# EAGLE design VCF-LM324-Stereo+LFO (EAGLE 7.6.0)
Voltage-Controlled Low-Pass Filter with LFO using LM324 Quad-Opamp (Stereo) http://electro-music.com/forum/topic-45231-0.html&postdays=0&postorder=asc&highlight=
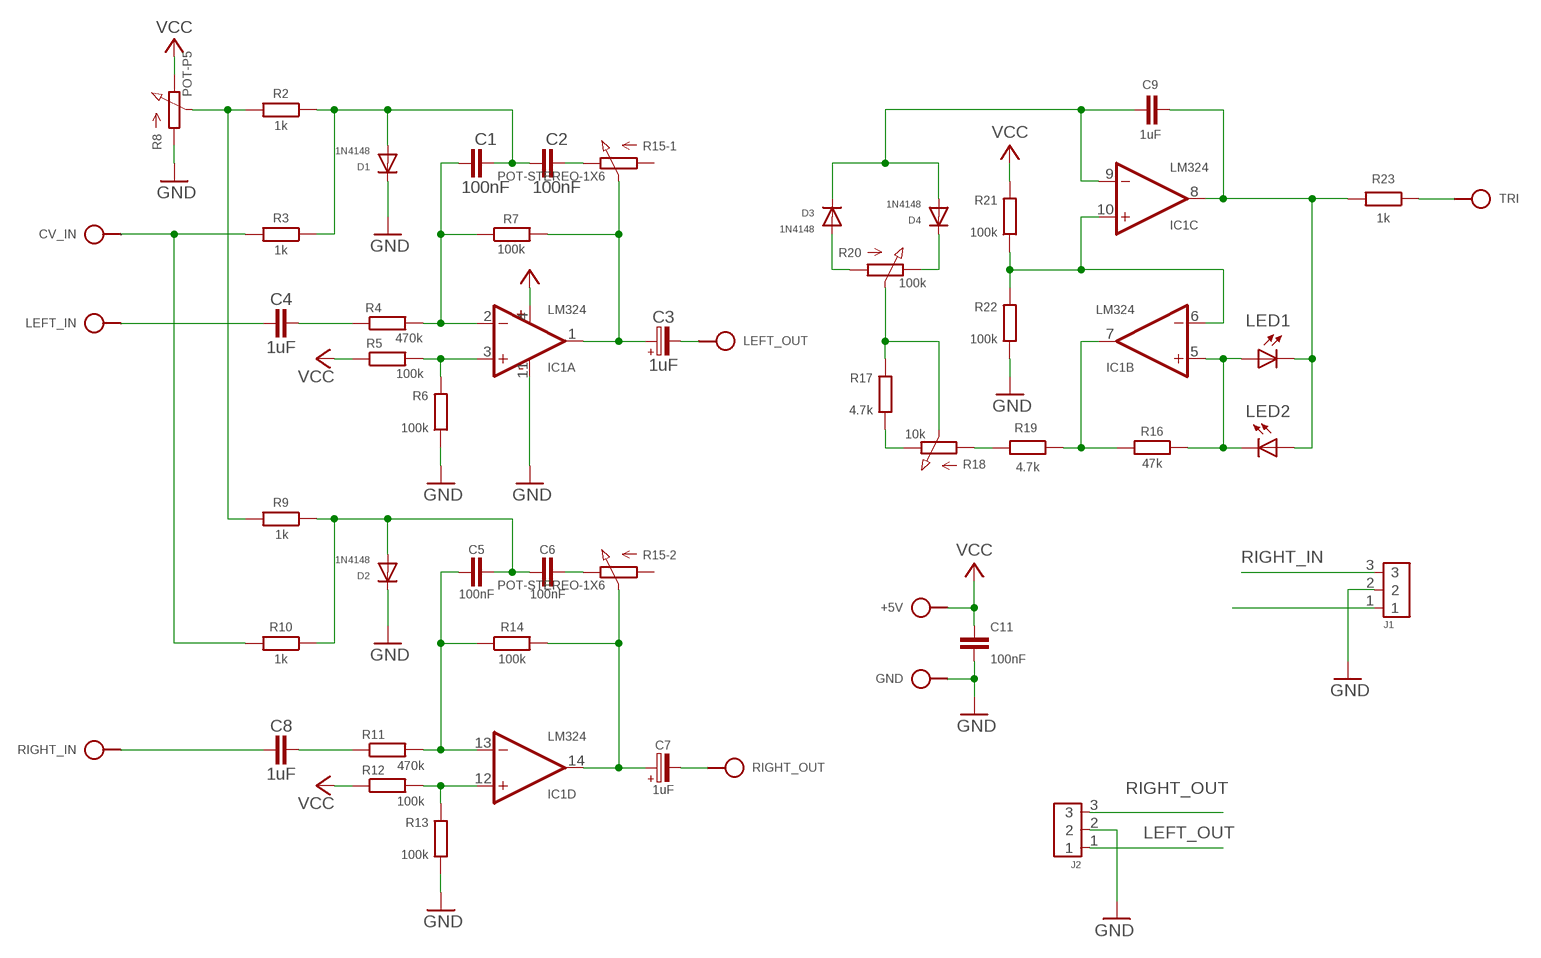
[diagram p0: schematic, sheet 1]

## Parts
+5V  VCC  SPAD  [SPAD]
C1  100nF  C050-024X044  [C050-024X044]
C2  100nF  C050-024X044  [C050-024X044]
C3  1uF  CPOLE2,5-3  [E2,5-3]
C4  1uF  C050-020X044  [C050-020X044]
C5  100nF  C050-024X044  [C050-024X044]
C6  100nF  C050-024X044  [C050-024X044]
C7  1uF  CPOLE2,5-3  [E2,5-3]
C8  1uF  C050-020X044  [C050-020X044]
C9  1uF  C050-024X044/V  [C050-024X044/V]
C11  100nF  C050-020X036  [C050-020X036]
CV_IN  CV_IN  SPAD  [SPAD]
D1  1N4148  1N414834-5  [DO34-5]
D2  1N4148  1N414834-7V  [DO34-7V]
D3  1N4148  1N414834-7V  [DO34-7V]
D4  1N4148  1N414834-7V  [DO34-7V]
GND  GND  SPAD  [SPAD]
IC1  LM324  LM324N  [DIL14]
J1  CONN-3P-3P  [CONN-3P]
J2  CONN-3P-3P  [CONN-3P]
LED1  LED3MM  [LED3MM]
LED2  LED3MM  [LED3MM]
LEFT_IN  AUDIO_IN  SPAD  [SPAD]
LEFT_OUT  AUDIO_OUT  SPAD  [SPAD]
R2  1k  R0204/10-V  [0204/10-V]
R3  1k  R0204/7-V  [0204/7-V]
R4  470k  R0204/10-V  [0204/10-V]
R5  100k  R0204V  [0204V]
R6  100k  R0204/10  [0204/10]
R7  100k  R0204/7-V  [0204/7-V]
R8  POT-P5  [POT-P5]
R9  1k  R0204/7-V  [0204/7-V]
R10  1k  R0202/7-V  [0202/7-V]
R11  470k  R0204/10  [0204/10]
R12  100k  R0204/7-V  [0204/7-V]
R13  100k  R0204V  [0204V]
R14  100k  R0204V  [0204V]
R15  POT-STEREO-1X6  [POT-STEREO-1X6]
R16  47k  R0204/7  [0204/7]
R17  4.7k  R0204/7  [0204/7]
R18  10k  POT  [POT]
R19  4.7k  R0204/7-V  [0204/7-V]
R20  100k  POT  [POT]
R21  100k  R0204/10  [0204/10]
R22  100k  R0202V  [0202V]
R23  1k  R0204/10  [0204/10]
RIGHT_IN  AUDIO_IN  SPAD  [SPAD]
RIGHT_OUT  AUDIO_OUT  SPAD  [SPAD]
TRI  TRIANGLE  SPAD  [SPAD]

## Nets
GND: C11.2 D1.C D2.C GND.1 IC1.11(P:V-) J1.2 J2.2 R6.1 R8.A R13.1 R22.1
LEFT_IN: C4.1 J1.1 LEFT_IN.1
LEFT_OUT: C3.- J2.1 LEFT_OUT.1
N$2: C1.1 IC1.2(A:-IN) R4.2 R7.1
N$3: C2.2 R15.1E(-1:E)
N$4: C3.+ IC1.1(A:OUT) R7.2 R15.1S(-1:S)
N$5: R2.2 R8.S R9.2
N$7: IC1.3(A:+IN) R5.2 R6.2
N$8: CV_IN.1 R3.2 R10.2
N$9: C1.2 C2.1 D1.A R2.1 R3.1
N$10: C4.2 R4.1
N$11: C6.2 R15.2E(-2:E)
N$12: C7.+ IC1.14(D:OUT) R14.2 R15.2S(-2:S)
N$13: IC1.12(D:+IN) R12.2 R13.2
N$14: IC1.7(B:OUT) R16.2 R19.1
N$15: IC1.5(B:+IN) LED1.A LED2.K(C) R16.1
N$16: C5.2 C6.1 D2.A R9.1 R10.1
N$17: C5.1 IC1.13(D:-IN) R11.2 R14.1
N$20: C8.2 R11.1
N$26: C9.1 D3.C D4.A IC1.9(C:-IN)
N$28: C9.2 IC1.8(C:OUT) LED1.K(C) LED2.A R23.2
OA_C_IN+: IC1.6(B:-IN) IC1.10(C:+IN) R21.1 R22.2
RIGHT_IN: C8.1 J1.3 RIGHT_IN.1
RIGHT_OUT: C7.- J2.3 RIGHT_OUT.1
TRI_OUT: R23.1 TRI.1
TRIM_1_A: D3.A R20.1(A)
TRIM_1_B: D4.C R20.3(E)
TRIM_2_A: R17.1 R18.3(E)
TRIM_2_B: R18.1(A) R19.2
TRIM_P: R17.2 R18.2(S) R20.2(S)
VCC: +5V.1 C11.1 IC1.4(P:V+) R5.1 R8.E R12.1 R21.2
Unconnected: R15.1A(-1:A) R15.2A(-2:A)

## Library data of the parts
+5V CV_IN GND LEFT_IN LEFT_OUT RIGHT_IN RIGHT_OUT TRI = pad:SPAD
C1 C2 C4-C6 C8 C9 C11 = c:C: CAPACITOR, European symbol
C3 C7 = c:CPOL: POLARIZED CAPACITOR, European symbol
D1-D4 = d:1N4148
IC1 = ic:LM324: OP AMP
J1 J2 = pinconn:CONN-3P
LED1 LED2 = led:LED: LED OSRAM: - CHIPLED LG R971, LG N971, LY N971, LG Q971, LY Q971, LO R971, LY R971 LH N974, LH R974 LS Q976, LO Q976, LY Q976 LO Q996 - Hyper CHIPLED LW Q18S LB Q993, LB Q99A, LB R99A - SideLED LS A670, LO A670, LY A670, LG A670, LP A670 LB A673, LV A673, LT A673, LW A673 LH A674 LY A675 LS A676, LA A676, LO A676, LY A676, LW A676 LS A679, LY A679, LG A679 - Hyper Micro SIDELED@@ LS Y876, LA Y876, LO Y876, LY Y876 LT Y87S - SmartLED LW L88C, LW L88S LB L89C, LB L89S, LG L890 LS L89K, LO L89K, LY L89K LS L896, LA L896, LO L896, LY L896 - TOPLED LS T670, LO T670, LY T670, LG T670, LP T670 LSG T670, LSP T670, LSY T670, LOP T670, LYG T670 LG T671, LOG T671, LSG T671 LB T673, LV T673, LT T673, LW T673 LH T674 LS T676, LA T676, LO T676, LY T676, LB T676, LH T676, LSB T676, LW T676 LB T67C, LV T67C, LT T67C, LS T67K, LO T67K, LY T67K, LW E67C LS E67B, LA E67B, LO E67B, LY E67B, LB E67C, LV E67C, LT E67C LW T67C LS T679, LY T679, LG T679 LS T770, LO T770, LY T770, LG T770, LP T770 LB T773, LV T773, LT T773, LW T773 LH T774 LS E675, LA E675, LY E675, LS T675 LS T776, LA T776, LO T776, LY T776, LB T776 LHGB T686 LT T68C, LB T68C - Hyper Mini TOPLED@@ LB M676 - Mini TOPLED Santana@@ LG M470 LS M47K, LO M47K, LY M47K Source: http://www.osram.convergy.de LUXEON: - LUMILED@@ LXK2-PW12-R00, LXK2-PW12-S00, LXK2-PW14-U00, LXK2-PW14-V00 LXK2-PM12-R00, LXK2-PM12-S00, LXK2-PM14-U00 LXK2-PE12-Q00, LXK2-PE12-R00, LXK2-PE12-S00, LXK2-PE14-T00, LXK2-PE14-U00 LXK2-PB12-K00, LXK2-PB12-L00, LXK2-PB12-M00, LXK2-PB14-N00, LXK2-PB14-P00, LXK2-PB14-Q00 LXK2-PR12-L00, LXK2-PR12-M00, LXK2-PR14-Q00, LXK2-PR14-R00 LXK2-PD12-Q00, LXK2-PD12-R00, LXK2-PD12-S00 LXK2-PH12-R00, LXK2-PH12-S00 LXK2-PL12-P00, LXK2-PL12-Q00, LXK2-PL12-R00 Source: www.luxeon.com KINGBRIGHT: KA-3528ASYC Source: www.kingbright.com
R2-R7 R9-R14 R16 R17 R19 R21-R23 = r:R: RESISTOR, European symbol
R8 R18 R20 = r:POT
R15 = r:POT-STEREO

## Module LFO
Ports: TRI_OUT(io) GND(io) VCC(io)
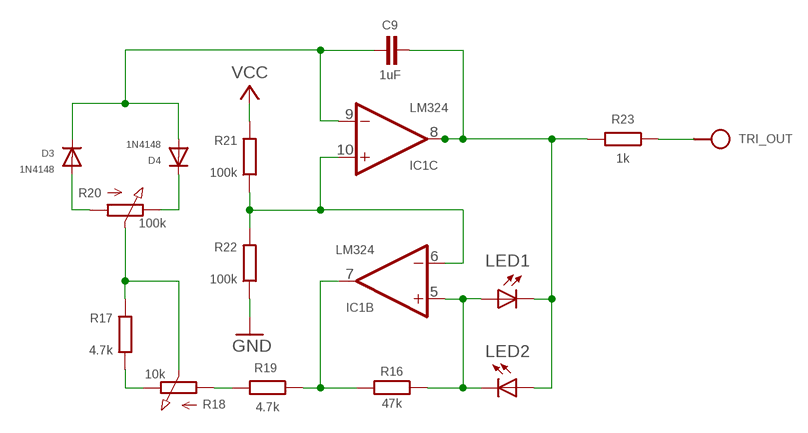
[diagram p1: schematic, module LFO, sheet 1]

### Parts
C9  1uF  C050-024X044/V  [C050-024X044/V]
D3  1N4148  1N414834-7V  [DO34-7V]
D4  1N4148  1N414834-7V  [DO34-7V]
IC1  LM324  LM324N  [DIL14]
LED1  LED3MM  [LED3MM]
LED2  LED3MM  [LED3MM]
R16  47k  R0202/7-V  [0202/7-V]
R17  4.7k  R0202/7  [0202/7]
R18  10k  POT  [POT]
R19  4.7k  R0202/7-V  [0202/7-V]
R20  100k  POT  [POT]
R21  100k  R0202/7-V  [0202/7-V]
R22  100k  R0202/7-V  [0202/7-V]
R23  1k  R0202/7-V  [0202/7-V]
TRI_OUT  TRIANGLE  SPAD  [SPAD]

### Nets
GND: R22.1
N$14: IC1.7(B:OUT) R16.2 R19.1
N$15: IC1.5(B:+IN) LED1.A LED2.K(C) R16.1
N$26: C9.1 D3.C D4.A IC1.9(C:-IN)
N$28: C9.2 IC1.8(C:OUT) LED1.K(C) LED2.A R23.2
OA_C_IN+: IC1.6(B:-IN) IC1.10(C:+IN) R21.1 R22.2
TRI_OUT: R23.1 TRI_OUT.1
TRIM_1_A: D3.A R20.1(A)
TRIM_1_B: D4.C R20.3(E)
TRIM_2_A: R17.1 R18.3(E)
TRIM_2_B: R18.1(A) R19.2
TRIM_P: R17.2 R18.2(S) R20.2(S)
VCC: R21.2
Unconnected: IC1.1(A:OUT) IC1.2(A:-IN) IC1.3(A:+IN) IC1.12(D:+IN) IC1.13(D:-IN) IC1.14(D:OUT)

### Power pins joined to a net without a drawn wire
V+: IC1.4(P:V+)
V-: IC1.11(P:V-)

### Library data of the parts
C9 = c:C: CAPACITOR, European symbol
D3 D4 = d:1N4148
IC1 = ic:LM324: OP AMP
LED1 LED2 = led:LED: LED OSRAM: - CHIPLED LG R971, LG N971, LY N971, LG Q971, LY Q971, LO R971, LY R971 LH N974, LH R974 LS Q976, LO Q976, LY Q976 LO Q996 - Hyper CHIPLED LW Q18S LB Q993, LB Q99A, LB R99A - SideLED LS A670, LO A670, LY A670, LG A670, LP A670 LB A673, LV A673, LT A673, LW A673 LH A674 LY A675 LS A676, LA A676, LO A676, LY A676, LW A676 LS A679, LY A679, LG A679 - Hyper Micro SIDELED@@ LS Y876, LA Y876, LO Y876, LY Y876 LT Y87S - SmartLED LW L88C, LW L88S LB L89C, LB L89S, LG L890 LS L89K, LO L89K, LY L89K LS L896, LA L896, LO L896, LY L896 - TOPLED LS T670, LO T670, LY T670, LG T670, LP T670 LSG T670, LSP T670, LSY T670, LOP T670, LYG T670 LG T671, LOG T671, LSG T671 LB T673, LV T673, LT T673, LW T673 LH T674 LS T676, LA T676, LO T676, LY T676, LB T676, LH T676, LSB T676, LW T676 LB T67C, LV T67C, LT T67C, LS T67K, LO T67K, LY T67K, LW E67C LS E67B, LA E67B, LO E67B, LY E67B, LB E67C, LV E67C, LT E67C LW T67C LS T679, LY T679, LG T679 LS T770, LO T770, LY T770, LG T770, LP T770 LB T773, LV T773, LT T773, LW T773 LH T774 LS E675, LA E675, LY E675, LS T675 LS T776, LA T776, LO T776, LY T776, LB T776 LHGB T686 LT T68C, LB T68C - Hyper Mini TOPLED@@ LB M676 - Mini TOPLED Santana@@ LG M470 LS M47K, LO M47K, LY M47K Source: http://www.osram.convergy.de LUXEON: - LUMILED@@ LXK2-PW12-R00, LXK2-PW12-S00, LXK2-PW14-U00, LXK2-PW14-V00 LXK2-PM12-R00, LXK2-PM12-S00, LXK2-PM14-U00 LXK2-PE12-Q00, LXK2-PE12-R00, LXK2-PE12-S00, LXK2-PE14-T00, LXK2-PE14-U00 LXK2-PB12-K00, LXK2-PB12-L00, LXK2-PB12-M00, LXK2-PB14-N00, LXK2-PB14-P00, LXK2-PB14-Q00 LXK2-PR12-L00, LXK2-PR12-M00, LXK2-PR14-Q00, LXK2-PR14-R00 LXK2-PD12-Q00, LXK2-PD12-R00, LXK2-PD12-S00 LXK2-PH12-R00, LXK2-PH12-S00 LXK2-PL12-P00, LXK2-PL12-Q00, LXK2-PL12-R00 Source: www.luxeon.com KINGBRIGHT: KA-3528ASYC Source: www.kingbright.com
R16 R17 R19 R21-R23 = r:R: RESISTOR, European symbol
R18 R20 = r:POT
TRI_OUT = pad:SPAD

## Module VCF-L
Ports: 

### Library data of the parts

## Board
Voltage-Controlled Low-Pass Filter with LFO using LM324 Quad-Opamp (Stereo) http://electro-music.com/forum/topic-45231-0.html&postdays=0&postorder=asc&highlight=
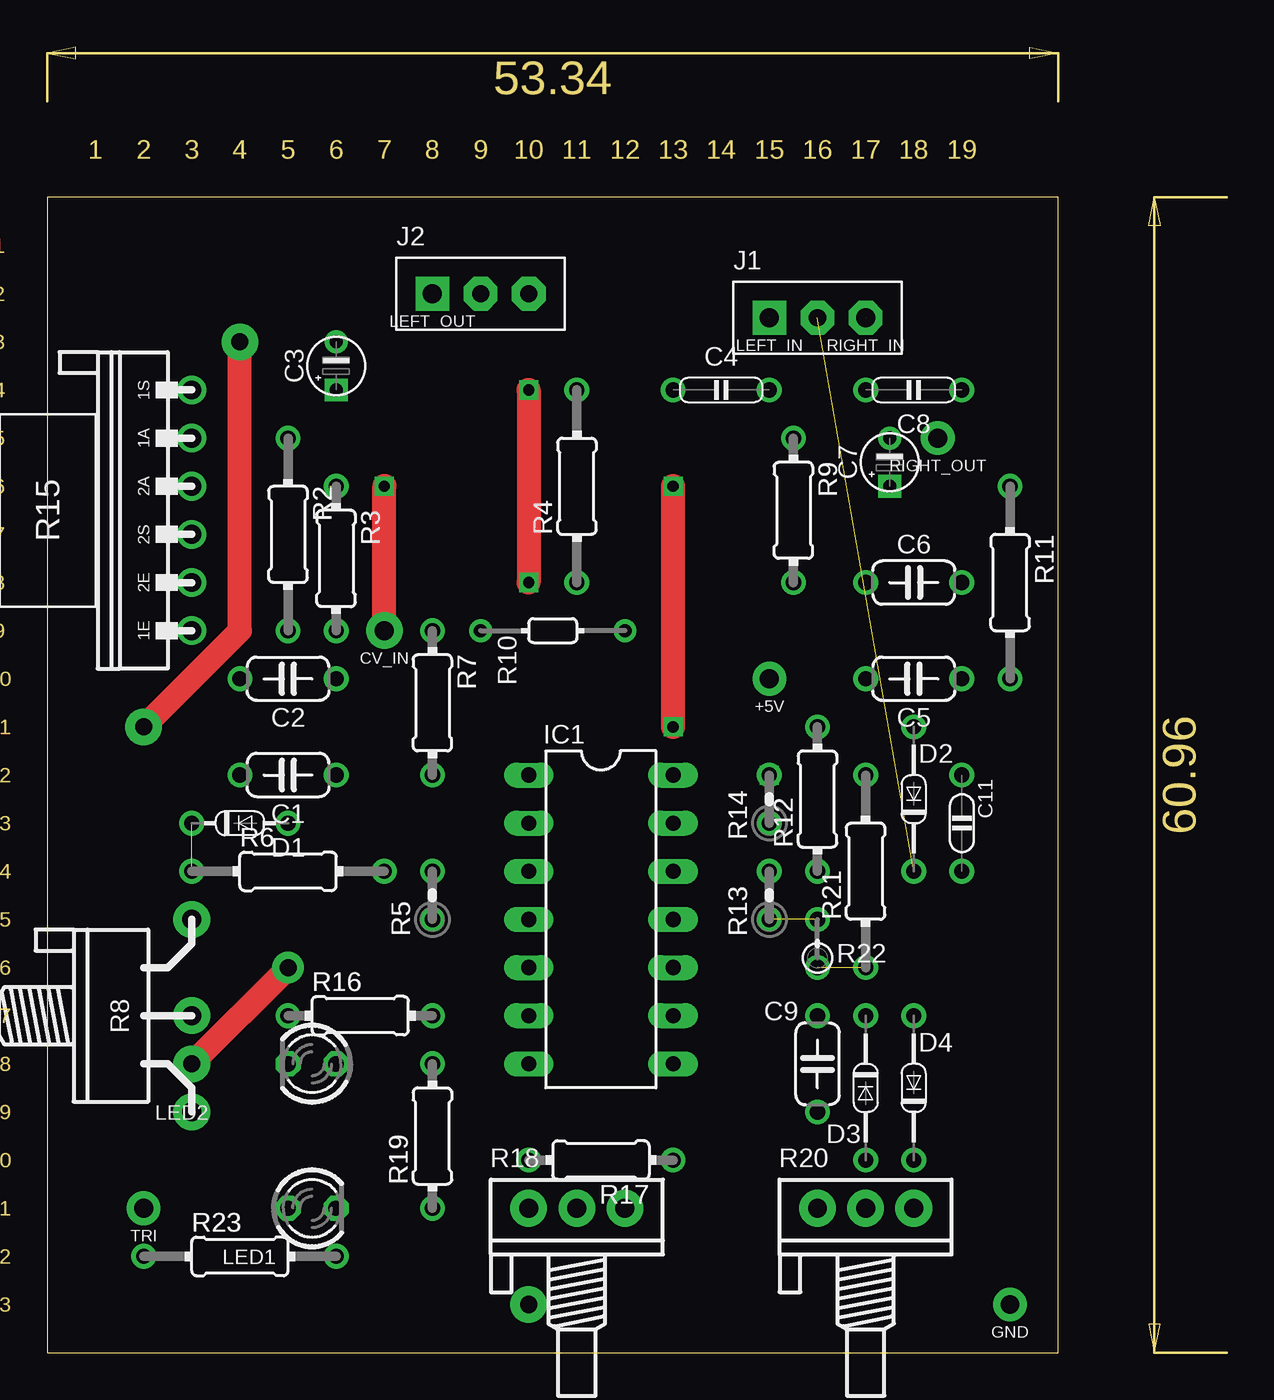
[diagram p2: board, top side]
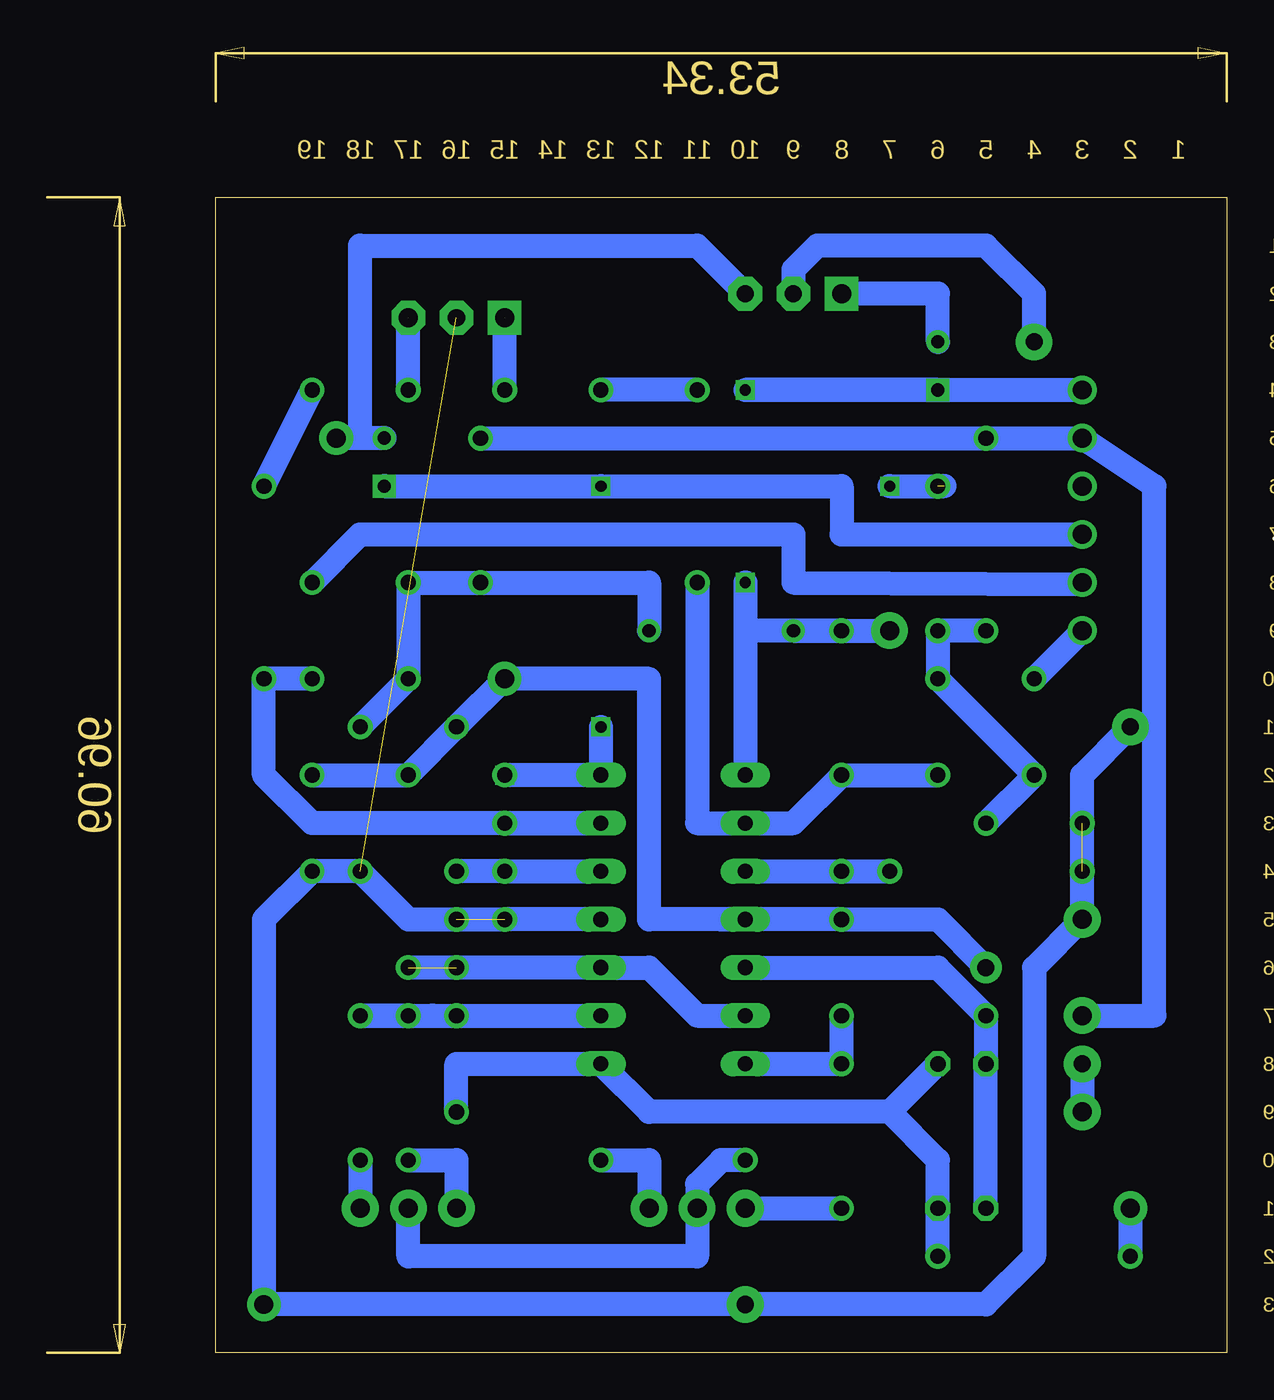
[diagram p3: board, bottom side, seen from below]

Size 53.34 x 60.96 mm. Coordinates in mm from the lower left corner, seen from the top.
Outline: 0,0 53.34,0 53.34,60.96 0,60.96 0,0
Copper layers (1*16): Top 0.035mm / dielectric 1.5mm / Bottom 0.035mm
Design rules "default *": minimum track width 10mil, minimum drill 24mil, track to track 8mil, track to pad 8mil, pad to pad 8mil, via to via 8mil, smd to smd 8mil, copper to edge 40mil, drill to drill 8mil, minimum pad ring 10mil, minimum via ring 8mil, stop-mask expansion 0mil, vias tented up to drill 0mil, thermal gap 10mil

### Footprints (pad centres in the part's own frame; a part is rotated, then mirrored left to right if it is on the bottom)
SPAD = drill 1 pad 1.778: 1 0,0
C050-024X044 = drill 0.8: 1 -2.54,0; 2 2.54,0
E2,5-3 = drill 0.7 square: + 0,1.27 | drill 0.7: - 0,-1.27
C050-020X044 = drill 0.8: 1 2.54,0; 2 -2.54,0
C050-024X044/V = drill 0.8: 1 0,2.54; 2 0,-2.54
C050-020X036 = drill 0.8: 1 -2.54,0; 2 2.54,0
DO34-5 = drill 0.8: A 2.54,0; C -2.54,0
DO34-7V = drill 0.8: A 0,3.81; C 0,-3.81
DIL14 = drill 0.8 long: 1 -3.81,7.62; 2 -3.81,5.08; 3 -3.81,2.54; 4 -3.81,0; 5 -3.81,-2.54; 6 -3.81,-5.08; 7 -3.81,-7.62; 8 3.81,-7.62; 9 3.81,-5.08; 10 3.81,-2.54; 11 3.81,0; 12 3.81,2.54; 13 3.81,5.08; 14 3.81,7.62
CONN-3P = drill 0.9 pad 1.778 square: 1 0,0 | drill 0.9 pad 1.778 octagon: 2 2.54,0; 3 5.08,0
LED3MM = drill 0.813 octagon: A -1.27,0; K 1.27,0
0204/10-V = drill 0.8: 1 0,5.08; 2 0,-5.08
0204/7-V = drill 0.8: 1 0,3.81; 2 0,-3.81
0204V = drill 0.8: 1 -1.27,0; 2 1.27,0
0204/10 = drill 0.8: 1 -5.08,0; 2 5.08,0
POT-P5 = drill 1 pad 1.93: A -5.08,3.81; E 5.08,3.81; S 0,3.81
0202/7-V = drill 0.7: 1 0,-3.81; 2 0,3.81
POT-STEREO-1X6 = drill 1: 1A -3.81,2.54; 1E 6.35,2.54; 1S -6.35,2.54; 2A -1.27,2.54; 2E 3.81,2.54; 2S 1.27,2.54
0204/7 = drill 0.8: 1 -3.81,0; 2 3.81,0
POT = drill 1 pad 1.93: 1 -2.54,0; 2 0,0; 3 2.54,0
0202V = drill 0.8: 1 0,-1.27; 2 0,1.27

### Placement (x,y rotation side)
+5V  38.1,35.56 90 top
C1  12.7,30.48 180 top
C2  12.7,35.56 180 top
C3  15.24,52.07 180 top
C4  35.56,50.8 0 top
C5  45.72,35.56 180 top
C6  45.72,40.64 0 top
C7  44.45,46.99 180 top
C8  45.72,50.8 180 top
C9  40.64,15.24 0 top
C11  48.26,27.94 270 top
CV_IN  17.78,38.1 90 top
D1  10.16,27.94 0 top
D2  45.72,29.21 0 top
D3  43.18,13.97 180 top
D4  45.72,13.97 0 top
GND  50.8,2.54 90 top
IC1  29.21,22.86 0 top
J1  38.1,54.61 0 top
J2  20.32,55.88 0 top
LED1  13.97,7.62 0 top
LED2  13.97,15.24 180 top
LEFT_IN  38.1,54.61 90 top
LEFT_OUT  20.32,55.88 90 top
R2  12.7,43.18 180 top
R3  15.24,41.91 180 top
R4  27.94,45.72 0 top
R5  20.32,24.13 90 top
R6  12.7,25.4 0 top
R7  20.32,34.29 180 top
R8  3.81,17.78 270 top
R9  39.37,44.45 180 top
R10  26.67,38.1 90 top
R11  50.8,40.64 270 top
R12  40.64,29.21 0 top
R13  38.1,24.13 90 top
R14  38.1,29.21 90 top
R15  5.08,44.45 270 top
R16  16.51,17.78 0 top
R17  29.21,10.16 180 top
R18  27.94,7.62 0 top
R19  20.32,11.43 0 top
R20  43.18,7.62 0 top
R21  43.18,25.4 90 top
R22  40.64,21.59 180 top
R23  10.16,5.08 0 top
RIGHT_IN  43.18,54.61 90 top
RIGHT_OUT  46.99,48.26 90 top
TRI  5.08,7.62 90 top

### Tracks (layer width: path | path; a pad name or v marks a point on that pad's centre or on a via)
GND  (via drill 0.9 pad 1.93)  (3 unrouted)
  Top 1.27: v5.08,33.02 10.16,38.1 v10.16,53.34
  Bottom 1.27: IC1.11 R13.1 43.18,22.86 D2.C C11.2 50.8,22.86 GND.1 v25.4,2.54 12.7,2.54 10.16,5.08 10.16,20.32 R8.A D1.C 7.62,30.48 v5.08,33.02 | v10.16,53.34 10.16,55.88 12.7,58.42 21.59,58.42 22.86,57.15 J2.2
LEFT_IN  (1 unrouted)
  Bottom 1.27: C4.1 J1.1
LEFT_OUT
  Bottom 1.27: C3.- 15.24,55.88 LEFT_OUT.1
N$2
  Bottom 1.27: R4.2 27.94,27.94 IC1.2 22.86,27.94 R7.1 C1.1
N$3
  Bottom 1.27: R15.1E C2.2
N$4  (via drill 0.6)
  Top 1.27: v25.4,50.8 v25.4,40.64
  Bottom 1.27: C3.+ v25.4,50.8 R15.1S | R7.2 25.4,38.1 | v25.4,40.64 25.4,38.1 | 25.4,38.1 IC1.1
N$5
  Bottom 1.27: R9.2 R2.2 7.62,48.26 3.81,45.72 3.81,17.78 R8.S
N$7
  Bottom 1.27: IC1.3 R5.2 R6.2
N$8  (via drill 0.6, 0.9 pad 1.93)  (1 unrouted)
  Top 1.27: CV_IN.1 v17.78,45.72
  Bottom 1.27: v17.78,45.72 14.9,45.72 | R10.2 CV_IN.1
  other vias: 17.78,38.1 17.78,38.1
N$9
  Bottom 1.27: R2.1 R3.1 C2.1 C1.2 D1.A
N$10
  Bottom 1.27: R4.1 C4.2
N$11
  Bottom 1.27: C6.2 45.72,43.18 22.86,43.18 22.86,40.64 7.54,40.56 R15.2E
N$12  (via drill 0.6)
  Top 1.27: v33.02,33.02 v33.02,45.72
  Bottom 1.27: v33.02,33.02 IC1.14 R14.2 | C7.+ v33.02,45.72 20.32,45.72 20.32,43.18 R15.2S
  other vias: 38.1,30.48
N$13
  Bottom 1.27: IC1.12 R13.2 R12.2
N$14
  Bottom 1.27: IC1.7 R19.1 R16.2
N$15
  Bottom 1.27: LED1.A LED2.K R16.1 15.24,20.32 IC1.5
N$16
  Bottom 1.27: D2.A C5.2 C6.1 R9.1 30.48,40.64 R10.1
N$17
  Bottom 1.27: R14.1 IC1.13 48.26,27.94 50.8,30.48 R11.2 C5.1
N$20
  Bottom 1.27: C8.2 R11.1
N$26
  Bottom 1.27: 41.91,17.78 D4.A D3.C C9.1 IC1.9
N$28
  Bottom 1.27: 17.78,12.7 30.48,12.7 IC1.8 40.64,15.24 C9.2 | R23.2 LED1.K 15.24,10.16 17.78,12.7 | 17.78,12.7 LED2.A
OA_C_IN+  (1 unrouted)
  Bottom 1.27: R21.1 IC1.10 30.48,20.32 27.94,17.78 IC1.6
RIGHT_IN  (1 unrouted)
  Bottom 1.27: C8.1 J1.3
RIGHT_OUT
  Bottom 1.27: RIGHT_OUT.1 C7.- 45.72,48.26 45.72,58.42 27.94,58.42 J2.3
TRI_OUT
  Bottom 1.27: TRI.1 R23.1
TRIM_1_A
  Bottom 1.27: D3.A 40.64,10.16 R20.1
TRIM_1_B
  Bottom 1.27: D4.C R20.3
TRIM_2_A
  Bottom 1.27: R17.1 30.48,10.16 R18.3
TRIM_2_B
  Bottom 1.27: R18.1 R19.2
TRIM_P
  Bottom 1.27: R17.2 26.67,10.16 27.94,8.89 R18.2 27.94,5.08 43.18,5.08 R20.2
VCC  (via drill 0.6, 0.9 pad 1.68, 0.9 pad 1.93)
  Top 1.27: v12.7,20.32 v7.62,15.24
  Bottom 1.27: 26.67,22.86 IC1.4 | IC1.4 30.48,22.86 30.48,35.56 +5V.1 R12.1 R21.2 C11.1 | v12.7,20.32 15.24,22.86 R5.1 IC1.4 | v7.62,15.24 R8.E
  other vias: 38.1,35.56

### Text on the board
Dimension: 1 | 2 | 3 | 4 | 5 | 6 | 7 | 8 | 9 | 10 | 11 | 12 | 13 | 14 | 15 | 16 | 17 | 18 | 19 | 1 | 2 | 3 | 4 | 5 | 6 | 7 | 8 | 9 | 10 | 11 | 12 | 13 | 14 | 15 | 16 | 17 | 18 | 19 | 20 | 21 | 22 | 23
tDocu: RES | Cutoff | LFO freq | LFO duty